# Altium schematic sheet pca20035_sheet2_nrf91_mcu.SchDoc: Thingy:91 nRF9160 MCU
size A3; Organization: Nordic Semiconductor; DocumentNumber: 2; SheetNumber: 2; SheetTotal: 6; CompanyName: Nordic Semiconductor; DocumentSize: A3
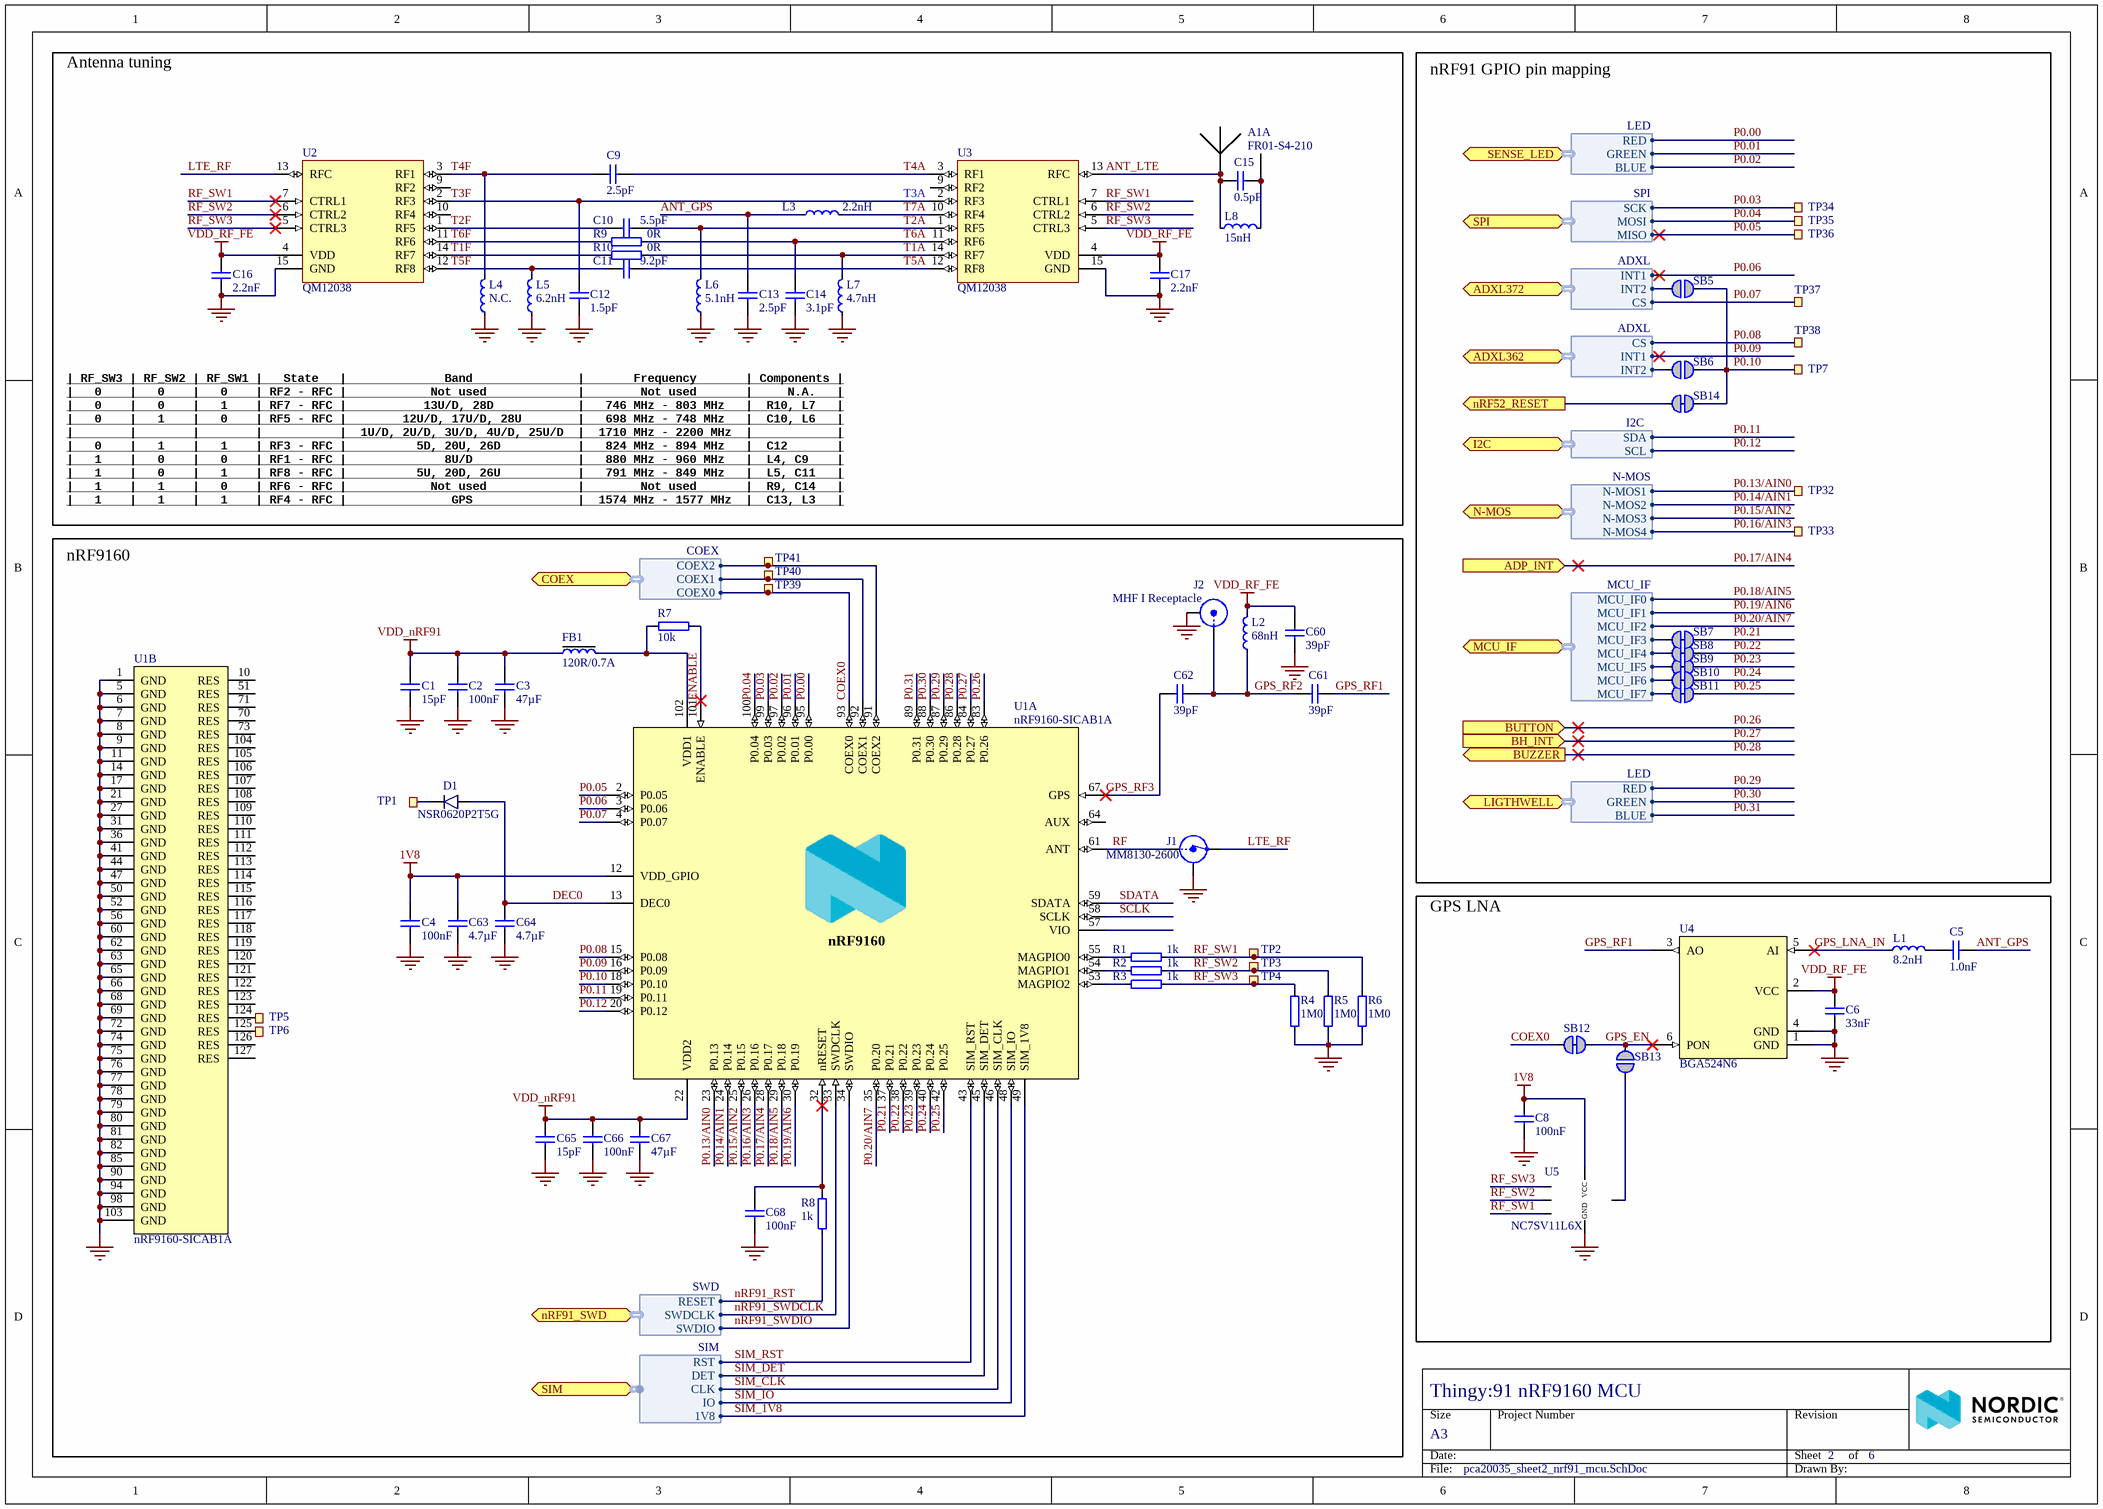
[diagram p0: pca20035_sheet2_nrf91_mcu.SchDoc]

## Parts
A1  FR01-S4-210  [FR01-S4-210_DF]  (part A of 2)
C1  15pF  [CAPC0603X03L_C]
C2  100nF  [CAPC0603X03L_C]
C3  47µF  [CAPC2012X11L]
C4  100nF  [CAPC0603X03L_C]
C5  1.0nF  [CAPC0603X03L_C]
C6  33nF  [CAPC0603X03L_C]
C8  100nF  [CAPC0603X03L_C]
C9  2.5pF  [CAPC0603X03L_C]
C10  5.5pF  [CAPC0603X03L_C]
C11  9.2pF  [CAPC0603X03L_C]
C12  1.5pF  [CAPC0603X03L_C]
C13  2.5pF  [CAPC1005X04L]
C14  3.1pF  [CAPC0603X03L_C]
C15  0.5pF  [CAPC1005X04L]
C16  2.2nF  [CAPC0603X03L_C]
C17  2.2nF  [CAPC0603X03L_C]
C60  39pF  [CAPC0603X03L_C]
C61  39pF  [CAPC0603X03L_C]
C62  39pF  [CAPC0603X03L_C]
C63  4.7µF  [CAPC1608X06L]
C64  4.7µF  [CAPC1608X06L]
C65  15pF  [CAPC0603X03L_C]
C66  100nF  [CAPC0603X03L_C]
C67  47µF  [CAPC2012X11L]
C68  100nF  [CAPC0603X03L_C]
D1  NSR0620P2T5G  [SODFL100X40-2N]
FB1  120R/0.7A  [INDC1005X04L]
J1  MM8130-2600  [COAXIAL-SWF]
J2  MHF I Receptacle  [COAXIAL RF U.FL-R-SMT-1]
L1  8.2nH  [INDC1608X06L_WW]
L2  68nH  [INDC1005X04L_WW]
L3  2.2nH  [INDC1005X04L_WW]
L4  N.C.  [INDC0603X03L_C_NC]
L5  6.2nH  [INDC0603X03L_C]
L6  5.1nH  [INDC0603X03L_C]
L7  4.7nH  [INDC0603X03L_C]
L8  15nH  [INDC1608X06L_WW]
R1  1k  [RESC0603X03L_C]
R2  1k  [RESC0603X03L_C]
R3  1k  [RESC0603X03L_C]
R4  1M0  [RESC0603X03L_C]
R5  1M0  [RESC0603X03L_C]
R6  1M0  [RESC0603X03L_C]
R7  10k  [RESC0603X03L_C]
R8  1k  [RESC0603X03L_C]
R9  0R  [RESC0603X03L_C]
R10  0R  [RESC0603X03L_C]
SB5  Solderbridge  [Solderbridge]  (value not drawn)  (no BOM)
SB6  Solderbridge  [Solderbridge]  (value not drawn)  (no BOM)
SB7  Solderbridge  [Solderbridge_Shorted]  (value not drawn)  (net tie, no BOM)
SB8  Solderbridge  [Solderbridge_Shorted]  (value not drawn)  (net tie, no BOM)
SB9  Solderbridge  [Solderbridge_Shorted]  (value not drawn)  (net tie, no BOM)
SB10  Solderbridge  [Solderbridge_Shorted]  (value not drawn)  (net tie, no BOM)
SB11  Solderbridge  [Solderbridge_Shorted]  (value not drawn)  (net tie, no BOM)
SB12  Solderbridge  [Solderbridge_Shorted]  (value not drawn)  (net tie, no BOM)
SB13  Solderbridge  [Solderbridge]  (value not drawn)  (no BOM)
SB14  Solderbridge  [Solderbridge_Shorted]  (value not drawn)  (net tie, no BOM)
TP1  Ø1.0mm,SMD  [TP_SMD_Ø1.0mm]  (value not drawn)  (no BOM)
TP2  Ø1.0mm,SMD  [TP_SMD_Ø1.0mm]  (value not drawn)  (no BOM)
TP3  Ø1.0mm,SMD  [TP_SMD_Ø1.0mm]  (value not drawn)  (no BOM)
TP4  Ø1.0mm,SMD  [TP_SMD_Ø1.0mm]  (value not drawn)  (no BOM)
TP5  Ø0.7mm,SMD  [TP_SMD_Ø0.7mm]  (value not drawn)  (no BOM)
TP6  Ø0.7mm,SMD  [TP_SMD_Ø0.7mm]  (value not drawn)  (no BOM)
TP7  Ø1.0mm,SMD  [TP_SMD_Ø1.0mm]  (value not drawn)  (no BOM)
TP32  Ø1.5mm,SMD  [TP_SMD_Ø1.5mm]  (value not drawn)  (no BOM)
TP33  Ø1.5mm,SMD  [TP_SMD_Ø1.5mm]  (value not drawn)  (no BOM)
TP34  Ø1.0mm,SMD  [TP_SMD_Ø1.0mm]  (value not drawn)  (no BOM)
TP35  Ø1.0mm,SMD  [TP_SMD_Ø1.0mm]  (value not drawn)  (no BOM)
TP36  Ø1.0mm,SMD  [TP_SMD_Ø1.0mm]  (value not drawn)  (no BOM)
TP37  Ø1.0mm,SMD  [TP_SMD_Ø1.0mm]  (value not drawn)  (no BOM)
TP38  Ø1.0mm,SMD  [TP_SMD_Ø1.0mm]  (value not drawn)  (no BOM)
TP39  Ø1.0mm,SMD  [TP_SMD_Ø1.0mm]  (value not drawn)  (no BOM)
TP40  Ø1.0mm,SMD  [TP_SMD_Ø1.0mm]  (value not drawn)  (no BOM)
TP41  Ø1.0mm,SMD  [TP_SMD_Ø1.0mm]  (value not drawn)  (no BOM)
U1  nRF9160-SICAB1A  [LGA50P1600X1050X104-161N]  (parts A,B of 2)
U2  QM12038  [UFQFN40P200X200X65_HS-15N]
U3  QM12038  [UFQFN40P200X200X65_HS-15N]
U4  BGA524N6  [XFDFN40P100X55-6N]
U5  NC7SV11L6X  [DFN1410-6N]

## Blocks framed on the sheet
Antenna tuning: A1 C9-C17 L3-L8 R9 R10 U2 U3
nRF91 GPIO pin mapping: SB5-SB11 SB14 TP7 TP32-TP38
nRF9160: C1-C4 C60-C68 D1 FB1 J1 J2 L2 R1-R8 TP1-TP6 TP39-TP41 U1
GPS LNA: C5 C6 C8 L1 SB12 SB13 U4 U5

## Ports
ADP_INT (in), ADXL362 (bidir, harness ADXL), ADXL372 (bidir, harness ADXL), BH_INT (in), BUTTON (in), BUZZER (out), COEX (bidir, harness COEX), I2C (bidir, harness I2C), LIGTHWELL (bidir, harness LED), MCU_IF (bidir, harness MCU_IF), N-MOS (bidir, harness N-MOS), nRF52_RESET (out), nRF91_SWD (bidir, harness SWD), SENSE_LED (bidir, harness LED), SIM (bidir, harness SIM), SPI (bidir, harness SPI)

## Harnesses
SWD: SWDIO, SWDCLK, RESET
I2C: SDA, SCL
MCU_IF: MCU_IF0, MCU_IF1, MCU_IF2, MCU_IF3, MCU_IF4, MCU_IF5, MCU_IF6, MCU_IF7
LED: BLUE, GREEN, RED
COEX: COEX2, COEX1, COEX0
SPI: MISO, MOSI, SCK
N-MOS: N-MOS1, N-MOS2, N-MOS3, N-MOS4
ADXL: CS, INT2, INT1
SIM: DET, RST, CLK, IO, 1V8

## Nets
1V8: C4.1 C8.2 C63.1 U1.12(VDD_GPIO) U5.5(VCC)
GND: C1.2 C2.2 C3.2 C4.2 C6.1 C8.1 C12.1 C13.1 C14.1 C16.1 C17.1 C60.1 C63.2 C64.2 C65.2 C66.2 C67.2 C68.2 J1.2(Shield) J2.2(Y) L4.1 L5.1 L6.1 L7.1 R4.1 R5.1 R6.1 U1.1(GND) U1.5(GND) U1.6(GND) U1.7(GND) U1.8(GND) U1.9(GND) U1.11(GND) U1.14(GND) U1.17(GND) U1.21(GND) U1.27(GND) U1.31(GND) U1.36(GND) U1.41(GND) U1.44(GND) U1.47(GND) U1.50(GND) U1.52(GND) U1.56(GND) U1.60(GND) U1.62(GND) U1.63(GND) U1.65(GND) U1.66(GND) U1.68(GND) U1.69(GND) U1.72(GND) U1.74(GND) U1.75(GND) U1.76(GND) U1.77(GND) U1.78(GND) U1.79(GND) U1.80(GND) U1.81(GND) U1.82(GND) U1.85(GND) U1.90(GND) U1.94(GND) U1.98(GND) U1.103(GND) U2.15(GND) U3.15(GND) U4.1(GND) U4.4(GND) U5.2(GND)
VDD_nRF91: C1.1 C2.1 C3.1 C65.1 C66.1 C67.1 FB1.1 U1.22(VDD2)
VDD_RF_FE: C6.2 C16.2 C17.2 C60.2 L2.1 U2.4(VDD) U3.4(VDD) U4.2(VCC)
ANT_GPS: C5.1 C13.2 L3.1
ANT_LTE: A1.1(Feed_A) C15.1 L8.1 U3.13(RFC)
COEX0: SB12.1 TP39.1 U1.93(COEX0) ; port COEX.COEX0
DEC0: C64.1 D1.2(A) U1.13(DEC0)
ENABLE: R7.2 U1.101(ENABLE)
GPS_EN: SB12.2 SB13.2 U4.6(PON)
GPS_LNA_IN: L1.1 U4.5(AI)
GPS_RF1: C61.2 U4.3(AO)
GPS_RF2: C61.1 C62.2 J2.1(X) L2.2
GPS_RF3: C62.1 U1.67(GPS)
LTE_RF: J1.3(OUT) U2.13(RFC)
nRF52_RESET: SB14.2 ; port nRF52_RESET
nRF91_RST: R8.1 ; port nRF91_SWD.RESET
nRF91_SWDCLK: U1.33(SWDCLK) ; port nRF91_SWD.SWDCLK
nRF91_SWDIO: U1.34(SWDIO) ; port nRF91_SWD.SWDIO
P0.00: U1.95(P0.00) ; port SENSE_LED.RED
P0.01: U1.96(P0.01) ; port SENSE_LED.GREEN
P0.02: U1.97(P0.02) ; port SENSE_LED.BLUE
P0.03: TP34.1 U1.99(P0.03) ; port SPI.SCK
P0.04: TP35.1 U1.100(P0.04) ; port SPI.MOSI
P0.05: TP36.1 U1.2(P0.05) ; port SPI.MISO
P0.06: U1.3(P0.06) ; port ADXL372.INT1
P0.07: TP37.1 U1.4(P0.07) ; port ADXL372.CS
P0.08: TP38.1 U1.15(P0.08) ; port ADXL362.CS
P0.09: U1.16(P0.09) ; port ADXL362.INT1
P0.10: SB5.1 SB6.1 SB14.1 TP7.1 U1.18(P0.10)
P0.11: U1.19(P0.11) ; port I2C.SDA
P0.12: U1.20(P0.12) ; port I2C.SCL
P0.13/AIN0: TP32.1 U1.23(P0.13) ; port N-MOS.N-MOS1
P0.14/AIN1: U1.24(P0.14) ; port N-MOS.N-MOS2
P0.15/AIN2: U1.25(P0.15) ; port N-MOS.N-MOS3
P0.16/AIN3: TP33.1 U1.26(P0.16) ; port N-MOS.N-MOS4
P0.17/AIN4: U1.28(P0.17) ; port ADP_INT
P0.18/AIN5: U1.29(P0.18) ; port MCU_IF.MCU_IF0
P0.19/AIN6: U1.30(P0.19) ; port MCU_IF.MCU_IF1
P0.20/AIN7: U1.35(P0.20) ; port MCU_IF.MCU_IF2
P0.21: SB7.2 U1.37(P0.21)
P0.22: SB8.2 U1.38(P0.22)
P0.23: SB9.2 U1.39(P0.23)
P0.24: SB10.2 U1.40(P0.24)
P0.25: SB11.2 U1.42(P0.25)
P0.26: U1.83(P0.26) ; port BUTTON
P0.27: U1.84(P0.27) ; port BH_INT
P0.28: U1.86(P0.28) ; port BUZZER
P0.29: U1.87(P0.29) ; port LIGTHWELL.RED
P0.30: U1.88(P0.30) ; port LIGTHWELL.GREEN
P0.31: U1.89(P0.31) ; port LIGTHWELL.BLUE
RF: J1.1(IN) U1.61(ANT)
RF_SW1: R1.2 R6.2 TP2.1 U2.7(CTRL1) U3.7(CTRL1) U5.6(C)
RF_SW2: R2.2 R5.2 TP3.1 U2.6(CTRL2) U3.6(CTRL2) U5.3(B)
RF_SW3: R3.2 R4.2 TP4.1 U2.5(CTRL3) U3.5(CTRL3) U5.1(A)
SCLK: U1.58(SCLK)
SDATA: U1.59(SDATA)
SIM_1V8: U1.49(SIM_1V8) ; port SIM.1V8
SIM_CLK: U1.46(SIM_CLK) ; port SIM.CLK
SIM_DET: U1.45(SIM_DET) ; port SIM.DET
SIM_IO: U1.48(SIM_IO) ; port SIM.IO
SIM_RST: U1.43(SIM_RST) ; port SIM.RST
T1A: L7.2 R10.1 U3.14(RF7)
T1F: R10.2 U2.14(RF7)
T2A: C10.1 L6.2 U3.1(RF5)
T2F: C10.2 U2.1(RF5)
T3F: C12.2 U2.2(RF3) U3.2(RF3)
T4A: C9.1 U3.3(RF1)
T4F: C9.2 L4.2 U2.3(RF1)
T5A: C11.1 U3.12(RF8)
T5F: C11.2 L5.2 U2.12(RF8)
T6A: C14.2 R9.1 U3.11(RF6)
T6F: R9.2 U2.11(RF6)
T7A: L3.2 U3.10(RF4)
NetA1_2: A1.2(Tuning_A) C15.2 L8.2
NetC5_2: C5.2 L1.2
NetC68_1: C68.1 R8.2 U1.32(nRESET)
NetD1_1: D1.1(C) TP1.1
NetFB1_2: FB1.2 R7.1 U1.102(VDD1)
NetR1_1: R1.1 U1.55(MAGPIO0)
NetR2_1: R2.1 U1.54(MAGPIO1)
NetR3_1: R3.1 U1.53(MAGPIO2)
NetSB5_2: SB5.2 ; port ADXL372.INT2
NetSB6_2: SB6.2 ; port ADXL362.INT2
NetSB7_1: SB7.1 ; port MCU_IF.MCU_IF3
NetSB8_1: SB8.1 ; port MCU_IF.MCU_IF4
NetSB9_1: SB9.1 ; port MCU_IF.MCU_IF5
NetSB10_1: SB10.1 ; port MCU_IF.MCU_IF6
NetSB11_1: SB11.1 ; port MCU_IF.MCU_IF7
NetSB13_1: SB13.1 U5.4(Y)
NetTP5_1: TP5.1 U1.124(RES)
NetTP6_1: TP6.1 U1.125(RES)
NetTP40_1: TP40.1 U1.92(COEX1) ; port COEX.COEX1
NetTP41_1: TP41.1 U1.91(COEX2) ; port COEX.COEX2

Not connected (* = marked no-connect by the designer): U1 10(RES) 51(RES) 57(VIO) 64(AUX) 70(RES) 71(RES) 73(RES) 104(RES) 105(RES) 106(RES) 107(RES) 108(RES) 109(RES) 110(RES) 111(RES) 112(RES) 113(RES) 114(RES) 115(RES) 116(RES) 117(RES) 118(RES) 119(RES) 120(RES) 121(RES) 122(RES) 123(RES) 126(RES) 127(RES); U2 8(NC) 9(RF2) 10(RF4); U3 8(NC) 9(RF2)

## Notes on the sheet
- (near U3) T3A
- | RF_SW3 | RF_SW2 | RF_SW1 |   State   |              Band               |       Frequency       | Components |
  |   0    |   0    |   0    | RF2 - RFC |            Not used             |        Not used       |     N.A.   |
  |   0    |   0    |   1    | RF7 - RFC |           13U/D, 28D            |   746 MHz - 803 MHz   |  R10, L7   |
  |   0    |   1    |   0    | RF5 - RFC |        12U/D, 17U/D, 28U        |   698 MHz - 748 MHz   |  C10, L6   |
  |        |        |        |           |  1U/D, 2U/D, 3U/D, 4U/D, 25U/D  |  1710 MHz - 2200 MHz  |            |
  |   0    |   1    |   1    | RF3 - RFC |          5D, 20U, 26D           |   824 MHz - 894 MHz   |  C12       |
  |   1    |   0    |   0    | RF1 - RFC |              8U/D               |   880 MHz - 960 MHz   |  L4, C9    |
  |   1    |   0    |   1    | RF8 - RFC |          5U, 20D, 26U           |   791 MHz - 849 MHz   |  L5, C11   |
  |   1    |   1    |   0    | RF6 - RFC |            Not used             |        Not used       |  R9, C14   |
  |   1    |   1    |   1    | RF4 - RFC |               GPS               |  1574 MHz - 1577 MHz  |  C13, L3   |
- Size
- Date:
- A3
- Project Number
- Sheet         of
- Revision
- File:
- Drawn By:
- (in symbol nRF9160-SICAB1A, part A) nRF9160

## Library data of the parts
A1 = FR01-S4-210-D: Mobile IoT LTE Multi-Band Antenna; Manufacturer: Fractus Antennas; Part number IPS: 80000001819; Note: N.A.; Pad Count: 5; Part Number: FR01-S4-210-D; Manufacturer Part Number: FR01-S4-210; ComponentLink1URL: https://www.fractusantennas.com/wp-content/uploads/2018/01/DS_FR01-S4-210.pdf; ComponentLink1Description: Datasheet; ComponentLink2URL: https://www.fractusantennas.com/trio-mxtend-mobile-iot-antenna/; ComponentLink2Description: Supplier link; HelpURL: https://www.fractusantennas.com/wp-content/uploads/2018/02/UM_FR01-S4-210.pdf; Footprint Doc: FR01-S4-210; LatestRevisionDate: 2018-07-09; Published: 2018-07-09; Value: FR01-S4-210; Artikkelnr Noca: N.A.; Supplier 1: N.A.; Supplier Part Number 1: N.A.; Supplier 2: N.A.; Supplier Part Number 2: N.A.; Component Class: Antennas; PartId: 100700054
C1 C65 = C0201-15p: Capacitor, NP0, ±5%, 25V; Manufacturer: N.A.; Part number IPS: 00000003193; Pad Count: 2; Part Number: C0201-15p; Manufacturer Part Number: N.A.; ComponentLink1URL: N.A.; ComponentLink1Description: Datasheet; ComponentLink2URL: N.A.; ComponentLink2Description: Supplier link; HelpURL: N.A.; Footprint Doc: 0201; LatestRevisionDate: 2020-10-13; Published: 2014-11-13; Value: 15pF; Note: 25V; Artikkelnr Noca: N.A.; Supplier 1: N.A.; Supplier Part Number 1: N.A.; Supplier 2: N.A.; Supplier Part Number 2: N.A.; Component Class: Capacitors; PartId: 100200034
C2 C4 C8 C66 C68 = C0201-100n: Capacitor, X5R, ±10%; Manufacturer: N.A.; Part number IPS: 00000001248, 00000002505; Note: 16V; Pad Count: 2; Part Number: C0201-100n; Manufacturer Part Number: N.A.; ComponentLink1URL: N.A.; ComponentLink1Description: Datasheet; ComponentLink2URL: N.A.; ComponentLink2Description: Supplier link; HelpURL: N.A.; Footprint Doc: 0201; LatestRevisionDate: 2017-11-09; Published: 2014-11-13; Value: 100nF; Artikkelnr Noca: N.A.; Supplier 1: N.A.; Supplier Part Number 1: N.A.; Supplier 2: N.A.; Supplier Part Number 2: N.A.; Component Class: Capacitors; PartId: 100200078
C3 C67 = C0805-47µ-10V: Capacitor, X5R, ±20%, 10V; Manufacturer: Murata; Manufacturer Part Number: GRM21BR61A476ME15; Part number IPS: 00000004759; Artikkelnr Noca: N.A.; Pad Count: 2; Part Number: C0805-47µ-10V; ComponentLink1URL: https://search.murata.co.jp/Ceramy/image/img/A01X/G101/ENG/GRM21BR61A476ME15-01A.pdf; ComponentLink1Description: Datasheet; ComponentLink2URL: N.A.; ComponentLink2Description: Supplier link; HelpURL: https://www.murata.com/en-global/products/productdetail?partno=GRM21BR61A476ME15%23; Footprint Doc: 0805; LatestRevisionDate: 2020-10-23; Published: 2020-08-14; Value: 47µF; Note: 10V; Supplier 1: Digi-Key; Supplier Part Number 1: 490-9961-1-ND; Supplier 2: N.A.; Supplier Part Number 2: N.A.; Component Class: Capacitors; PartId: 100200288
C5 = C0201-1n0: Capacitor, X7R, ±10%, 25V; Manufacturer: N.A.; Part number IPS: 00000003206; Note: 16V; Pad Count: 2; Part Number: C0201-1n0; Manufacturer Part Number: N.A.; ComponentLink1URL: N.A.; ComponentLink1Description: Datasheet; ComponentLink2URL: N.A.; ComponentLink2Description: Supplier link; HelpURL: N.A.; Footprint Doc: 0201; LatestRevisionDate: 2020-10-13; Published: 2014-11-13; Value: 1.0nF; Artikkelnr Noca: N.A.; Supplier 1: N.A.; Supplier Part Number 1: N.A.; Supplier 2: N.A.; Supplier Part Number 2: N.A.; Component Class: Capacitors; PartId: 100200056
C6 = C0201-33n: Capacitor, X5R, ±10%; Manufacturer: N.A.; Part number IPS: 00000003839; Note: 10V; Pad Count: 2; Part Number: C0201-33n; Manufacturer Part Number: N.A.; ComponentLink1URL: N.A.; ComponentLink1Description: Datasheet; ComponentLink2URL: N.A.; ComponentLink2Description: Supplier link; HelpURL: N.A.; Footprint Doc: 0201; LatestRevisionDate: 2020-01-07; Published: 2014-11-13; Value: 33nF; Artikkelnr Noca: N.A.; Supplier 1: N.A.; Supplier Part Number 1: N.A.; Supplier 2: N.A.; Supplier Part Number 2: N.A.; Component Class: Capacitors; PartId: 100200073
C9 = C0201-2.5p-HQ-Murata: Capacitor, NP0, ±0.05pF, 25V; Manufacturer: Murata; Manufacturer Part Number: GJM0335C1E2R5WB01; Part number IPS: 00000001771, 80000001936; Artikkelnr Noca: N.A.; Pad Count: 2; Part Number: C0201-2.5p-HQ-Murata; ComponentLink1URL: N.A.; ComponentLink1Description: Datasheet; ComponentLink2URL: N.A.; ComponentLink2Description: Supplier link; HelpURL: https://psearch.en.murata.com/capacitor/product/GJM0335C1E2R5WB01%23.html; Footprint Doc: 0201; LatestRevisionDate: 2020-02-07; Published: 2019-01-14; Value: 2.5pF; Note: 25V; Supplier 1: N.A.; Supplier Part Number 1: N.A.; Supplier 2: N.A.; Supplier Part Number 2: N.A.; Component Class: Capacitors; PartId: 100200420
C10 = C0201-5.5p-HQ-Murata: Capacitor, NP0, ±0.05pF, 25V; Manufacturer: Murata; Manufacturer Part Number: GJM0332C1H5R5WB01; Part number IPS: 00000001772, 80000001937; Artikkelnr Noca: N.A.; Pad Count: 2; Part Number: C0201-5.5p-HQ-Murata; ComponentLink1URL: N.A.; ComponentLink1Description: Datasheet; ComponentLink2URL: N.A.; ComponentLink2Description: Supplier link; HelpURL: https://psearch.en.murata.com/capacitor/product/GJM0332C1H5R5WB01%23.html; Footprint Doc: 0201; LatestRevisionDate: 2019-10-28; Published: 2019-10-28; Value: 5.5pF; Note: 25V; Supplier 1: N.A.; Supplier Part Number 1: N.A.; Supplier 2: N.A.; Supplier Part Number 2: N.A.; Component Class: Capacitors; PartId: 100200425
C11 = C0201-9.2p-HQ-Murata: Capacitor, NP0, ±0.05pF, 25V; Manufacturer: Murata; Manufacturer Part Number: GJM0332C1E9R2WB01; Part number IPS: 80000001956; Artikkelnr Noca: N.A.; Pad Count: 2; Part Number: C0201-9.2p-HQ-Murata; ComponentLink1URL: N.A.; ComponentLink1Description: Datasheet; ComponentLink2URL: N.A.; ComponentLink2Description: Supplier link; HelpURL: https://psearch.en.murata.com/capacitor/product/GJM0332C1E9R2WB01%23.html; Footprint Doc: 0201; LatestRevisionDate: 2019-03-27; Published: 2019-03-27; Value: 9.2pF; Note: 25V; Supplier 1: N.A.; Supplier Part Number 1: N.A.; Supplier 2: N.A.; Supplier Part Number 2: N.A.; Component Class: Capacitors; PartId: 100200427
C12 = C0201-1.5p-HQ-Murata: Capacitor, NP0, ±0.05pF, 25V; Manufacturer: Murata; Manufacturer Part Number: GJM0334C1E1R5WB01; Part number IPS: 00000001774, 80000001939; Artikkelnr Noca: N.A.; Pad Count: 2; Part Number: C0201-1.5p-HQ-Murata; ComponentLink1URL: N.A.; ComponentLink1Description: Datasheet; ComponentLink2Description: Supplier link; HelpURL: https://psearch.en.murata.com/capacitor/product/GJM0334C1E1R5WB01%23.html; Footprint Doc: 0201; LatestRevisionDate: 2019-01-14; Published: 2019-01-14; Value: 1.5pF; Note: 25V; ComponentLink2URL: N.A.; Supplier 1: N.A.; Supplier Part Number 1: N.A.; Supplier 2: N.A.; Supplier Part Number 2: N.A.; Component Class: Capacitors; PartId: 100200418
C13 = C0402-2.5p-HQ-Murata: Capacitor, NP0, ±0.05pF, 50V; Manufacturer: Murata; Manufacturer Part Number: GJM1555C1H2R5WB01; Part number IPS: 00000004340; Artikkelnr Noca: N.A.; Pad Count: 2; Part Number: C0402-2.5p-HQ-Murata; ComponentLink1URL: N.A.; ComponentLink1Description: Datasheet; ComponentLink2Description: Supplier link; HelpURL: https://psearch.en.murata.com/capacitor/product/GJM1555C1H2R5WB01%23.html; Footprint Doc: 0402; LatestRevisionDate: 2020-02-07; Published: 2020-02-07; Value: 2.5pF; Note: 50V; ComponentLink2URL: N.A.; Supplier 1: Digi-Key; Supplier Part Number 1: 490-11208-1-ND; Supplier 2: N.A.; Supplier Part Number 2: N.A.; Component Class: Capacitors; PartId: 100200428
C14 = C0201-3.1p-HQ-Murata: Capacitor, NP0, ±0.05pF, 25V; Manufacturer: Murata; Manufacturer Part Number: GJM0335C1E3R1WB01; Part number IPS: 00000001776, 80000001941; Artikkelnr Noca: N.A.; Pad Count: 2; Part Number: C0201-3.1p-HQ-Murata; ComponentLink1URL: N.A.; ComponentLink1Description: Datasheet; ComponentLink2Description: Supplier link; HelpURL: https://psearch.en.murata.com/capacitor/product/GJM0335C1E3R1WB01%23.html; Footprint Doc: 0201; LatestRevisionDate: 2019-01-14; Published: 2019-01-14; Value: 3.1pF; Note: 25V; ComponentLink2URL: N.A.; Supplier 1: N.A.; Supplier Part Number 1: N.A.; Supplier 2: N.A.; Supplier Part Number 2: N.A.; Component Class: Capacitors; PartId: 100200423
C15 = C0402-0.5p-HQ-Murata: Capacitor, NP0, ±0.05pF, 50V; Manufacturer: Murata; Manufacturer Part Number: GJM1555C1HR50WB01; Part number IPS: 00000004293; Artikkelnr Noca: N.A.; Pad Count: 2; Part Number: C0402-0.5p-HQ-Murata; ComponentLink1URL: https://search.murata.co.jp/Ceramy/image/img/A01X/G101/ENG/GJM1555C1HR50WB01-01.pdf; ComponentLink1Description: Datasheet; ComponentLink2URL: N.A.; ComponentLink2Description: Supplier link; HelpURL: https://psearch.en.murata.com/capacitor/product/GJM1555C1HR50WB01%23.html; Footprint Doc: 0402; LatestRevisionDate: 2020-02-07; Published: 2020-02-07; Value: 0.5pF; Note: 50V; Supplier 1: Digi-Key; Supplier Part Number 1: 490-11250-1-ND; Supplier 2: Mouser; Supplier Part Number 2: 81-GJM1555C1HR50WB1D; Component Class: Capacitors; PartId: 100200434
C16 C17 = C0201-2n2: Capacitor, X7R, ±10%, 10V; Manufacturer: N.A.; Part number IPS: 00000001778; Pad Count: 2; Part Number: C0201-2n2; Manufacturer Part Number: N.A.; Footprint Doc: 0201; LatestRevisionDate: 2014-11-13; Published: 2014-11-13; Value: 2.2nF; Note: 10V; Artikkelnr Noca: N.A.; ComponentLink1URL: N.A.; ComponentLink1Description: Datasheet; ComponentLink2URL: N.A.; ComponentLink2Description: Supplier link; HelpURL: N.A.; Supplier 1: N.A.; Supplier Part Number 1: N.A.; Supplier 2: N.A.; Supplier Part Number 2: N.A.; Component Class: Capacitors; PartId: 100200060
C60-C62 = C0201-39p: Capacitor, NP0, ±1%, 25V; Manufacturer: Murata; Manufacturer Part Number: GRM0335C1E390FA01; Part number IPS: 00000001668; Artikkelnr Noca: N.A.; Pad Count: 2; Part Number: C0201-39p; ComponentLink1URL: N.A.; ComponentLink1Description: Datasheet; ComponentLink2URL: N.A.; ComponentLink2Description: Supplier link; HelpURL: N.A.; Footprint Doc: 0201; LatestRevisionDate: 2019-04-16; Published: 2019-04-16; Value: 39pF; Note: 25V; Supplier 1: N.A.; Supplier Part Number 1: N.A.; Supplier 2: N.A.; Supplier Part Number 2: N.A.; Component Class: Capacitors; PartId: 100200039
C63 C64 = C0603-4µ7: Capacitor, X5R, ±10%; Manufacturer: N.A.; Part number IPS: 00000007783; Note: 6.3V; Artikkelnr Noca: 20069060; Pad Count: 2; Manufacturer Part Number: N.A.; Footprint Doc: 0603; Value: 4.7µF; Part Number: C0603-4µ7; ComponentLink1URL: N.A.; ComponentLink1Description: Datasheet; ComponentLink2URL: N.A.; ComponentLink2Description: Supplier link; HelpURL: N.A.; LatestRevisionDate: 2009-11-23; Published: 2009-05-08; Supplier 1: N.A.; Supplier Part Number 1: N.A.; Supplier 2: N.A.; Supplier Part Number 2: N.A.; Component Class: Capacitors; PartId: 100200274
D1 = NSR0620P2T5G: 20V schottky barrier diode, Vf 350 mV @ 100 mA, Ir 2.0 µA @ 10 V, If 500 mA; Manufacturer: ON Semiconductor; Part number IPS: 00000009952; Note: N.A.; Artikkelnr Noca: 10029169; Pad Count: 2; Part Number: NSR0620P2T5G; Manufacturer Part Number: NSR0620P2T5G; LatestRevisionDate: 2016-07-07; Published: 2016-07-07; Value: NSR0620P2T5G; Footprint Doc: SOD-923; ComponentLink1URL: N.A.; ComponentLink1Description: Datasheet; ComponentLink2URL: N.A.; ComponentLink2Description: Supplier link; HelpURL: http://www.onsemi.com/pub_link/Collateral/NSR0620P2-D.PDF; Supplier 1: Digi-Key; Supplier Part Number 1: NSR0620P2T5GOSCT-ND; Supplier 2: N.A.; Supplier Part Number 2: N.A.; Component Class: Semiconductors; PartId: 101300131
FB1 = FB0402-120R@100M-700mA: Ferrite Bead, 120 Ohm @ 100MHz, 700mA, 130 mOhm Max; Manufacturer: Murata; Manufacturer Part Number: BLM15AX121SN1; Part number IPS: 00000004487; Note: N.A.; Pad Count: 2; Part Number: FB0402-120R@100M-700mA; ComponentLink1URL: https://www.murata.com/en-us/products/productdata/8796740059166/ENFA0018.pdf; ComponentLink1Description: Datasheet; ComponentLink2URL: N.A.; ComponentLink2Description: Supplier link; HelpURL: https://www.murata.com/products/productdetail?partno=BLM15AX121SN1%23; Footprint Doc: 0402; LatestRevisionDate: 2020-04-28; Published: 2020-04-28; Value: 120R/0.7A; Artikkelnr Noca: N.A.; Supplier 1: Digi-Key; Supplier Part Number 1: 490-5439-1-ND; Supplier 2: N.A.; Supplier Part Number 2: N.A.; Component Class: Inductors; PartId: 100300100
J1 = MM8130-2600: Coaxial Connector with Switch; Manufacturer: Murata; Part number IPS: 00000009955; Note: N.A.; Artikkelnr Noca: 55029011; Pad Count: 3; Part Number: MM8130-2600; Manufacturer Part Number: MM8130-2600; LatestRevisionDate: 2014-04-24; Published: 2014-04-24; Value: MM8130-2600; Footprint Doc: COAXIAL-SWF; ComponentLink1URL: N.A.; ComponentLink1Description: Datasheet; ComponentLink2URL: N.A.; ComponentLink2Description: Supplier link; HelpURL: http://www.murata.com/products/catalog/pdf/o33e.pdf; Supplier 1: Digi-Key; Supplier Part Number 1: 490-4981-1-ND; Supplier 2: Mouser; Supplier Part Number 2: 81-MM8130-2600RA2; Component Class: Connectors; PartId: 100500400
J2 = 20279-001E-03: Ultraminiature Coaxial Connector, 50 Ohm, SMD; Manufacturer: Wellshow; Part number IPS: 00000004436; Note: N.A.; Pad Count: 3; Part Number: 20279-001E-03; Manufacturer Part Number: 20279-001E-03; ComponentLink1URL: \\hizz\pro\app9717\Datasheet\connectors\Wellshow\20279C18.pdf; ComponentLink1Description: Datasheet; ComponentLink2URL: N.A.; ComponentLink2Description: Supplier link; HelpURL: N.A.; Footprint Doc: COAXIAL RF MHFI; LatestRevisionDate: 2020-04-28; Published: 2020-01-07; Value: MHF I Receptacle; Supplier 1: Cabcon; Supplier Part Number 1: 20279-001E-03; Supplier 2: Digi-Key; Supplier Part Number 2: H11891DKR-ND; Artikkelnr Noca: N.A.; Component Class: Connectors; PartId: 100500636
L1 = L0603-8n2-Wirewound-Murata: Inductor, 800mA, ±0.5nH, 58mΩ, Q=38 @ 250MHz; Manufacturer: Murata; Manufacturer Part Number: LQW18AN8N2D10; Part number IPS: 00000003972; Note: -55°C ~ 125°C; Artikkelnr Noca: N.A.; Pad Count: 2; Part Number: L0603-8n2-Wirewound-Murata; ComponentLink1URL: https://search.murata.co.jp/Ceramy/image/img/P02/JELF243A-0026.pdf; ComponentLink1Description: Datasheet; ComponentLink2Description: Supplier link; HelpURL: https://psearch.en.murata.com/inductor/product/LQW18AN8N2D10%23.html; Footprint Doc: 0603; LatestRevisionDate: 2019-10-25; Published: 2019-10-25; Value: 8.2nH; ComponentLink2URL: N.A.; Supplier 1: Digi-Key; Supplier Part Number 1: 490-6914-1-ND; Supplier 2: N.A.; Supplier Part Number 2: N.A.; Component Class: Inductors; PartId: 100300394
L2 = L0402-68n-Wirewound-Murata: Inductor, 140mA, ±2%, 1960mΩ, Q=20; Manufacturer: Murata; Manufacturer Part Number: LQW15AN68NG00; Part number IPS: 00000002494; Note: -55°C ~ 125°C; Artikkelnr Noca: N.A.; Pad Count: 2; Part Number: L0402-68n-Wirewound-Murata; ComponentLink1URL: https://search.murata.co.jp/Ceramy/image/img/P02/JELF243A-0050.pdf; ComponentLink1Description: Datasheet; ComponentLink2URL: N.A.; ComponentLink2Description: Supplier link; HelpURL: https://psearch.en.murata.com/inductor/product/LQW15AN68NG00%23.html; Footprint Doc: 0402; LatestRevisionDate: 2019-04-16; Published: 2019-04-16; Value: 68nH; Supplier 1: Digi-Key; Supplier Part Number 1: 490-6837-1-ND; Supplier 2: N.A.; Supplier Part Number 2: N.A.; Component Class: Inductors; PartId: 100300389
L3 = L0402-2n2-Wirewound-Murata: Inductor, 2530mA, ±0.2nH, 22mΩ, Q=30; Manufacturer: Murata; Manufacturer Part Number: LQW15AN2N2C80; Part number IPS: 00000003981; Note: -55°C ~ 125°C; Artikkelnr Noca: N.A.; Pad Count: 2; Part Number: L0402-2n2-Wirewound-Murata; ComponentLink1URL: https://search.murata.co.jp/Ceramy/image/img/P02/JELF243A-0100.pdf; ComponentLink1Description: Datasheet; ComponentLink2Description: Supplier link; HelpURL: https://psearch.en.murata.com/inductor/product/LQW15AN2N2C80%23.html; Footprint Doc: 0402; LatestRevisionDate: 2020-01-07; Published: 2019-04-16; Value: 2.2nH; ComponentLink2URL: N.A.; Supplier 1: Digi-Key; Supplier Part Number 1: 490-7633-1-ND; Supplier 2: N.A.; Supplier Part Number 2: N.A.; Component Class: Inductors; PartId: 100300289
L4 = L0201-N.C.: Not mounted; Manufacturer: N.A.; Assembly: Not mounted; Pad Count: 2; Part Number: L0201-N.C.; Manufacturer Part Number: N.A.; ComponentLink1URL: N.A.; ComponentLink1Description: Datasheet; ComponentLink2Description: Supplier link; HelpURL: N.A.; Footprint Doc: 0201; LatestRevisionDate: 2013-04-10; Published: 2013-04-10; Value: N.C.; Note: N.A.; Artikkelnr Noca: N.A.; Part number IPS: N.A.; ComponentLink2URL: N.A.; Supplier 1: N.A.; Supplier Part Number 1: N.A.; Supplier 2: N.A.; Supplier Part Number 2: N.A.; Component Class: Inductors; PartId: 100300001
L5 = L0201-6n2-Wirewound-Murata: Inductor, 360mA, ±5%, 220mOhm, Q=39; Manufacturer: Murata; Manufacturer Part Number: LQW03AW6N2J00; Part number IPS: 00000001915; Note: -55°C ~ 125°C; Artikkelnr Noca: N.A.; Pad Count: 2; Part Number: L0201-6n2-Wirewound-Murata; ComponentLink1URL: https://search.murata.co.jp/Ceramy/image/img/P02/JELF243A-0109.pdf; ComponentLink1Description: Datasheet; ComponentLink2Description: Supplier link; HelpURL: https://psearch.en.murata.com/inductor/product/LQW03AW6N2J00%23.html; Footprint Doc: 0201; LatestRevisionDate: 2018-10-22; Published: 2018-10-22; Value: 6.2nH; ComponentLink2URL: N.A.; Supplier 1: Digi-Key; Supplier Part Number 1: 490-13840-1-ND; Supplier 2: N.A.; Supplier Part Number 2: N.A.; Component Class: Inductors; PartId: 100300180
L6 = L0201-5n1-Wirewound-Murata: Inductor, 480mA, ±5%, 140mOhm, Q=45; Manufacturer: Murata; Manufacturer Part Number: LQW03AW5N1J00; Part number IPS: 00000001789; Note: -55°C ~ 125°C; Artikkelnr Noca: N.A.; Pad Count: 2; Part Number: L0201-5n1-Wirewound-Murata; ComponentLink1URL: https://search.murata.co.jp/Ceramy/image/img/P02/JELF243A-0109.pdf; ComponentLink1Description: Datasheet; ComponentLink2Description: Supplier link; HelpURL: https://psearch.en.murata.com/inductor/product/LQW03AW5N1J00%23.html; Footprint Doc: 0201; LatestRevisionDate: 2018-10-22; Published: 2018-10-22; Value: 5.1nH; ComponentLink2URL: N.A.; Supplier 1: Digi-Key; Supplier Part Number 1: 490-13839-1-ND; Supplier 2: N.A.; Supplier Part Number 2: N.A.; Component Class: Inductors; PartId: 100300176
L7 = L0201-4n7-Wirewound-Murata: Inductor, 620mA, ±5%, 90mOhm, Q=45; Manufacturer: Murata; Manufacturer Part Number: LQW03AW4N7J00; Part number IPS: 00000001790; Note: -55°C ~ 125°C; Artikkelnr Noca: N.A.; Pad Count: 2; Part Number: L0201-4n7-Wirewound-Murata; ComponentLink1URL: https://search.murata.co.jp/Ceramy/image/img/P02/JELF243A-0109.pdf; ComponentLink1Description: Datasheet; ComponentLink2Description: Supplier link; HelpURL: https://psearch.en.murata.com/inductor/product/LQW03AW4N7J00%23.html; Footprint Doc: 0201; LatestRevisionDate: 2018-10-22; Published: 2018-10-22; Value: 4.7nH; ComponentLink2URL: N.A.; Supplier 1: Digi-Key; Supplier Part Number 1: 490-13838-1-ND; Supplier 2: N.A.; Supplier Part Number 2: N.A.; Component Class: Inductors; PartId: 100300175
L8 = L0603-15n-Wirewound-Murata: Inductor, 700mA, ±5%, 85mΩ, Q=42 @ 250MHz; Manufacturer: Murata; Manufacturer Part Number: LQW18AN15NJ10; Part number IPS: 00000004111; Note: -55°C ~ 125°C; Artikkelnr Noca: N.A.; Pad Count: 2; Part Number: L0603-15n-Wirewound-Murata; ComponentLink1URL: https://search.murata.co.jp/Ceramy/image/img/P02/JELF243A-0026.pdf; ComponentLink1Description: Datasheet; ComponentLink2Description: Supplier link; HelpURL: https://psearch.en.murata.com/inductor/product/LQW18AN15NJ10%23.html; Footprint Doc: 0603; LatestRevisionDate: 2020-01-07; Published: 2019-01-11; Value: 15nH; ComponentLink2URL: N.A.; Supplier 1: Digi-Key; Supplier Part Number 1: 490-6867-1-ND; Supplier 2: Mouser; Supplier Part Number 2: 81-LQW18AN15NJ10D; Component Class: Inductors; PartId: 100300395
R1-R3 R8 = R0201-1k0: Resistor, ±1%, 0.05W; Manufacturer: N.A.; Part number IPS: 00000005786; Note: Chip Res 1%; Pad Count: 2; Part Number: R0201-1k0; Manufacturer Part Number: N.A.; ComponentLink1URL: N.A.; ComponentLink1Description: Datasheet; ComponentLink2URL: N.A.; ComponentLink2Description: Supplier link; HelpURL: N.A.; Footprint Doc: 0201; LatestRevisionDate: 2014-11-13; Published: 2014-11-13; Value: 1k; Supplier 1: N.A.; Supplier Part Number 1: N.A.; Supplier 2: N.A.; Supplier Part Number 2: N.A.; Artikkelnr Noca: N.A.; Component Class: Resistors; PartId: 100100043
R4-R6 = R0201-1M0: Resistor, ±1%, 0.05W; Manufacturer: N.A.; Part number IPS: 00000001418; Note: Chip Res 1%; Pad Count: 2; Part Number: R0201-1M0; Manufacturer Part Number: N.A.; Footprint Doc: 0201; LatestRevisionDate: 2014-11-13; Published: 2014-11-13; Value: 1M0; Artikkelnr Noca: N.A.; ComponentLink1URL: N.A.; ComponentLink1Description: Datasheet; ComponentLink2URL: N.A.; ComponentLink2Description: Supplier link; HelpURL: N.A.; Supplier 1: N.A.; Supplier Part Number 1: N.A.; Supplier 2: N.A.; Supplier Part Number 2: N.A.; Component Class: Resistors; PartId: 100100093
R7 = R0201-10k: Resistor, ±1%, 0.05W; Manufacturer: N.A.; Part number IPS: 00000001255; Note: Chip Res 1%; Pad Count: 2; Part Number: R0201-10k; Manufacturer Part Number: N.A.; ComponentLink1URL: N.A.; ComponentLink1Description: Datasheet; ComponentLink2URL: N.A.; ComponentLink2Description: Supplier link; HelpURL: N.A.; Footprint Doc: 0201; LatestRevisionDate: 2014-11-13; Published: 2014-11-13; Value: 10k; Artikkelnr Noca: N.A.; Supplier 1: N.A.; Supplier Part Number 1: N.A.; Supplier 2: N.A.; Supplier Part Number 2: N.A.; Component Class: Resistors; PartId: 100100065
R9 R10 = R0201-0R: Resistor, ±5%, 0.05W; Manufacturer: N.A.; Part number IPS: 00000003245; Note: Chip Res 5%; Pad Count: 2; Part Number: R0201-0R; Manufacturer Part Number: N.A.; ComponentLink1URL: N.A.; ComponentLink1Description: Datasheet; ComponentLink2URL: N.A.; ComponentLink2Description: Supplier link; HelpURL: N.A.; Footprint Doc: 0201; LatestRevisionDate: 2017-11-09; Published: 2014-11-13; Value: 0R; Artikkelnr Noca: N.A.; Supplier 1: N.A.; Supplier Part Number 1: N.A.; Supplier 2: N.A.; Supplier Part Number 2: N.A.; Component Class: Resistors; PartId: 100100001
SB5 SB6 SB13 = Solderbridge: Manufacturer: N.A.; Pad Count: 2; Part Number: Solderbridge; Manufacturer Part Number: N.A.; ComponentLink1URL: N.A.; ComponentLink1Description: Datasheet; ComponentLink2URL: N.A.; ComponentLink2Description: Supplier link; HelpURL: N.A.; Footprint Doc: Solderbridge; LatestRevisionDate: 2009-12-14; Published: 2009-12-14; Value: Solderbridge; Note: N.A.; Supplier 1: N.A.; Supplier Part Number 1: N.A.; Supplier 2: N.A.; Supplier Part Number 2: N.A.; Artikkelnr Noca: N.A.; Part number IPS: N.A.; Component Class: Connectors; PartId: 100500458
SB7-SB12 SB14 = Solderbridge Shorted: Shorted Solderbridge; Manufacturer: N.A.; Pad Count: 2; Part Number: Solderbridge Shorted; Manufacturer Part Number: N.A.; ComponentLink1URL: N.A.; ComponentLink1Description: Datasheet; ComponentLink2URL: N.A.; ComponentLink2Description: Supplier link; HelpURL: N.A.; Footprint Doc: Solderbridge_Shorted; LatestRevisionDate: 2012-08-07; Published: 2012-08-07; Value: Solderbridge; Note: N.A.; Supplier 1: N.A.; Supplier Part Number 1: N.A.; Supplier 2: N.A.; Supplier Part Number 2: N.A.; Artikkelnr Noca: N.A.; Part number IPS: N.A.; Component Class: Connectors; PartId: 100500459
TP1-TP4 TP7 TP34-TP41 = TP_SMD_Ø1.0MM: 1.0mm circular SMD testpad; Manufacturer: Nordic Semiconductor; Manufacturer Part Number: N.A.; Pad Count: 1; Part Number: TP_SMD_Ø1.0MM; Footprint Doc: TP_SMD_Ø1.0mm; LatestRevisionDate: 2013-06-11; Published: 2013-06-11; Value: Ø1.0mm,SMD; Note: N.A.; Artikkelnr Noca: N.A.; Part number IPS: N.A.; ComponentLink1URL: N.A.; ComponentLink1Description: Datasheet; ComponentLink2URL: N.A.; ComponentLink2Description: Supplier link; HelpURL: N.A.; Supplier 1: N.A.; Supplier Part Number 1: N.A.; Supplier 2: N.A.; Supplier Part Number 2: N.A.; Component Class: Connectors; PartId: 100500475
TP5 TP6 = TP_SMD_Ø0.7MM: 0.7mm circular SMD testpad; Manufacturer: Nordic Semiconductor; Manufacturer Part Number: N.A.; Pad Count: 1; Part Number: TP_SMD_Ø0.7MM; ComponentLink1URL: N.A.; ComponentLink1Description: Datasheet; ComponentLink2URL: N.A.; ComponentLink2Description: Supplier link; HelpURL: N.A.; Footprint Doc: TP_SMD_Ø0.7mm; LatestRevisionDate: 2017-12-14; Published: 2017-12-14; Value: Ø0.7mm,SMD; Note: N.A.; Supplier 1: N.A.; Supplier Part Number 1: N.A.; Supplier 2: N.A.; Supplier Part Number 2: N.A.; Artikkelnr Noca: N.A.; Part number IPS: N.A.; PartId: 100500474; Component Class: Connectors
TP32 TP33 = TP_SMD_Ø1.5MM: 1.5mm circular SMD testpad; Manufacturer: Nordic Semiconductor; Manufacturer Part Number: N.A.; Pad Count: 1; Part Number: TP_SMD_Ø1.5MM; Footprint Doc: TP_SMD_Ø1.5mm; LatestRevisionDate: 2016-06-02; Published: 2016-06-02; Value: Ø1.5mm,SMD; Note: N.A.; Artikkelnr Noca: N.A.; Part number IPS: N.A.; ComponentLink1URL: N.A.; ComponentLink1Description: Datasheet; ComponentLink2URL: N.A.; ComponentLink2Description: Supplier link; HelpURL: N.A.; Supplier 1: N.A.; Supplier Part Number 1: N.A.; Supplier 2: N.A.; Supplier Part Number 2: N.A.; Component Class: Connectors; PartId: 100500477
U1 = nRF9160-SICAB1A: Low power System-in-Package with integrated LTE-M/NB-IoT modem and GPS; Manufacturer: Nordic Semiconductor; Part number IPS: 80000002329; Note: N.A.; Pad Count: 161; Part Number: nRF9160-SICAB1A; Manufacturer Part Number: nRF9160-SICAB1A; Footprint Doc: LGA-161; Value: nRF9160-SICAB1A; ComponentLink1URL: N.A.; ComponentLink1Description: Datasheet; ComponentLink2URL: N.A.; ComponentLink2Description: Supplier link; HelpURL: N.A.; LatestRevisionDate: 2020-08-13; Published: 2020-08-13; Supplier 1: Nordic Semiconductor; Supplier Part Number 1: nRF9160-SICAB1A; Supplier 2: N.A.; Supplier Part Number 2: N.A.; Artikkelnr Noca: N.A.; Component Class: nRF_Devices; PartId: 102000165
U2 U3 = QM12038: SP8T Switch For 3G/4G Applications; Manufacturer: Qorvo; Part number IPS: 80000001821; Note: N.A.; Pad Count: 14; Part Number: QM12038; Manufacturer Part Number: QM12038; ComponentLink1URL: \\hizz\pro\app9717\Datasheet\integated circuits\qorvo\QM12038 Datasheet.pdf; ComponentLink1Description: Datasheet; ComponentLink2Description: Supplier link; HelpURL: N.A.; Footprint Doc: UFQFN-14; LatestRevisionDate: 2018-09-18; Published: 2018-09-18; Value: QM12038; Artikkelnr Noca: N.A.; Supplier 1: N.A.; Supplier Part Number 1: N.A.; Supplier 2: N.A.; Supplier Part Number 2: N.A.; ComponentLink2URL: N.A.; Component Class: Misc_ICs; PartId: 101900557
U4 = BGA524N6E6327XTSA1: GPS/GNSS Low-Noise Amplifier, 19.6dB Gain, 0.55dB Noise Figure, 1.5V to 3.3V Supply Range; Manufacturer: Infineon Technologies; Part number IPS: 00000004011; Note: N.A.; Pad Count: 6; Part Number: BGA524N6E6327XTSA1; Manufacturer Part Number: BGA524N6E6327XTSA1; Footprint Doc: XFDFN-6; Value: BGA524N6; ComponentLink1URL: https://www.infineon.com/dgdl/Infineon-BGA524N6-DS-v03_00-en.pdf?fileId=db3a304344e406b50144e44dfad302b9; ComponentLink1Description: Datasheet; ComponentLink2URL: N.A.; ComponentLink2Description: Supplier link; HelpURL: https://www.infineon.com/cms/en/product/rf-wireless-control/low-noise-amplifier-lna-ics/gps-glonass-compass-lna/bga524n6/; LatestRevisionDate: 2019-10-25; Published: 2019-10-25; Supplier 1: Digi-Key; Supplier Part Number 1: BGA524N6E6327XTSA1CT-ND; Supplier 2: Mouser; Supplier Part Number 2: 726-A524N6E6327XTSA1; Artikkelnr Noca: N.A.; Component Class: Misc_ICs; PartId: 101900596
U5 = NC7SV11L6X: Single 3-input AND gate; Manufacturer: ON Semiconductor; Part number IPS: 00000001709; Artikkelnr Noca: N.A.; Pad Count: 6; Part Number: NC7SV11L6X; Manufacturer Part Number: NC7SV11L6X; ComponentLink1URL: https://www.fairchildsemi.com/datasheets/NC/NC7SV11.pdf; ComponentLink1Description: Datasheet; ComponentLink2URL: N.A.; ComponentLink2Description: Supplier link; HelpURL: https://www.fairchildsemi.com/datasheets/NC/NC7SV11.pdf; Footprint Doc: UFDFN-6; LatestRevisionDate: 2018-09-27; Published: 2018-09-27; Value: NC7SV11L6X; Note: Single 3-input AND gate; Supplier 1: Digi-Key; Supplier Part Number 1: NC7SV11L6XCT-ND; Supplier 2: Mouser; Supplier Part Number 2: 512-NC7SV11L6X; Component Class: Misc_ICs; PartId: 101900559